# EAGLE design Loader (EAGLE 9.6.0)
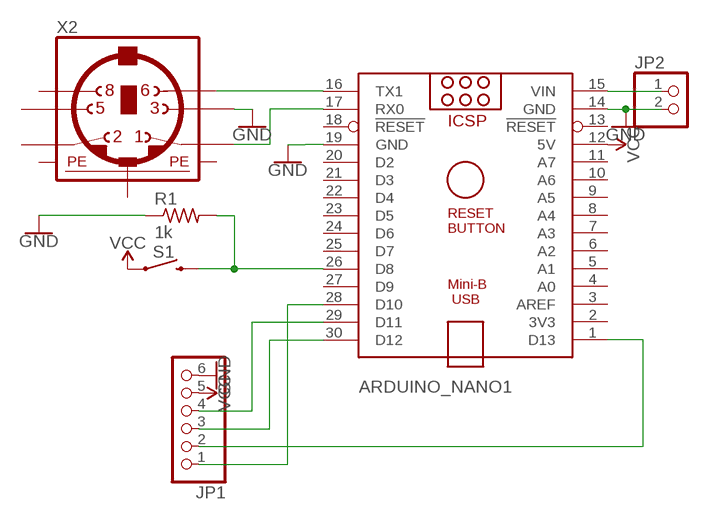
[diagram p0: schematic, sheet 1]

## Parts
ARDUINO_NANO1  ARDUINO_NANO  [ARDUINO_NANO]
JP1  PINHD-1X6  [1X06]
JP2  PINHD-1X2  [1X02]
R1  1k  R-US_0204/7  [0204/7]
S1  MOMENTARY-SWITCH-SPST-PTH-6.0MM  [TACTILE_SWITCH_PTH_6.0MM]
X2  MINI_DIN_6  [M_DIN6]

## Nets
GND: ARDUINO_NANO1.14(GND) ARDUINO_NANO1.19(GND) JP1.6 JP2.2 R1.1 X2.3
N$1: ARDUINO_NANO1.16(TX1) X2.6
N$2: ARDUINO_NANO1.17(RX0) X2.1
N$3: ARDUINO_NANO1.15(VIN) JP2.1
N$5: ARDUINO_NANO1.29(D11) JP1.4
N$6: ARDUINO_NANO1.30(D12) JP1.3
N$7: ARDUINO_NANO1.1(D13) JP1.2
N$8: ARDUINO_NANO1.28(D10) JP1.1
N$9: ARDUINO_NANO1.26(D8) R1.2 S1.3
VCC: ARDUINO_NANO1.12(5V) JP1.5 S1.1
Unconnected: ARDUINO_NANO1.2(3V3) ARDUINO_NANO1.3(AREF) ARDUINO_NANO1.4(A0) ARDUINO_NANO1.5(A1) ARDUINO_NANO1.6(A2) ARDUINO_NANO1.7(A3) ARDUINO_NANO1.8(A4) ARDUINO_NANO1.9(A5) ARDUINO_NANO1.10(A6) ARDUINO_NANO1.11(A7) ARDUINO_NANO1.13(!RESET) ARDUINO_NANO1.18(!RESET) ARDUINO_NANO1.20(D2) ARDUINO_NANO1.21(D3) ARDUINO_NANO1.22(D4) ARDUINO_NANO1.23(D5) ARDUINO_NANO1.24(D6) ARDUINO_NANO1.25(D7) ARDUINO_NANO1.27(D9) X2.2 X2.5 X2.8

## Power pins joined to a net without a drawn wire
PE1: X2.SH1(PE1)
PE2: X2.SH2(PE2)
PE3: X2.SH3(PE3)

## Library data of the parts
ARDUINO_NANO1 = ArduinoNanoV30:ARDUINO_NANO: Arduino Nano V3.0 Overview: The Arduino Nano is a small, complete, and breadboard-friendly board based on the ATmega328 (Arduino Nano 3.x) or ATmega168 (Arduino Nano 2.x). It has more or less the same functionality of the Arduino Duemilanove, but in a different package. It lacks only a DC power jack, and works with a Mini-B USB cable instead of a standard one. The Nano was designed and is being produced by Gravitech. Specifications: Microcontroller Atmel ATmega168 or ATmega328 Operating Voltage (logic level) 5 V Input Voltage (recommended) 7-12 V Input Voltage (limits) 6-20 V Digital I/O Pins 14 (of which 6 provide PWM output) Analog Input Pins 8 DC Current per I/O Pin 40 mA Flash Memory 16 KB (ATmega168) or 32 KB (ATmega328) of which 2 KB used by bootloader SRAM 1 KB (ATmega168) or 2 KB (ATmega328) EEPROM 512 bytes (ATmega168) or 1 KB (ATmega328) Clock Speed 16 MHz Dimensions 0.73" x 1.70" Length 45 mm Width 18 mm Weigth 5 g Power: The Arduino Nano can be powered via the Mini-B USB connection, 6-20V unregulated external power supply (pin 30), or 5V regulated external power supply (pin 27). The power source is automatically selected to the highest voltage source. Memory: The ATmega168 has 16 KB of flash memory for storing code (of which 2 KB is used for the bootloader); the ATmega328 has 32 KB, (also with 2 KB used for the bootloader). The ATmega168 has 1 KB of SRAM and 512 bytes of EEPROM (which can be read and written with the EEPROM library); the ATmega328 has 2 KB of SRAM and 1 KB of EEPROM. Input and Output: Each of the 14 digital pins on the Nano can be used as an input or output, using pinMode(), digitalWrite(), and digitalRead() functions. They operate at 5 volts. Each pin can provide or receive a maximum of 40 mA and has an internal pull-up resistor (disconnected by default) of 20-50 kOhms. In addition, some pins have specialized functions. Visit Arduino - ArduinoBoardNano <https://www.arduino.cc/en/Main/ArduinoBoardNano>
JP1 = adafruit:PINHD-1X6: PIN HEADER
JP2 = pinhead:PINHD-1X2: PIN HEADER
R1 = adafruit:R-US_: RESISTOR, American symbol
S1 = SparkFun-Switches:MOMENTARY-SWITCH-SPST: Momentary Switch (Pushbutton) - SPST Normally-open (NO) SPST momentary switches (buttons, pushbuttons). Variants PTH-12MM - 12mm square, through-hole Momentary Pushbutton Switch - 12mm Square <https://www.sparkfun.com/products/9190> (COM-09190) PTH-6.0MM, PTH-6.0MM-KIT - 6.0mm square, through-hole Mini Pushbutton Switch <https://www.sparkfun.com/products/97> (COM-00097) KIT package intended for soldering kit's - only one side of pads' copper is exposed. PTH-RIGHT-ANGLE-KIT - Right-angle, through-hole Right Angle Tactile Button <https://www.sparkfun.com/products/10791> - Used on SparkFun BigTime Watch Kit <https://www.sparkfun.com/products/11734> SMD-12MM - 12mm square, surface-mount Tactile Button - SMD (12mm) <https://www.sparkfun.com/products/12993> (COM-12993) Used on SparkFun PicoBoard <https://www.sparkfun.com/products/11888> SMD-4.5MM - 4.5mm Square Trackball Switch Used on SparkFun Blackberry Trackballer Breakout <https://www.sparkfun.com/products/13169> SMD-4.6MMX2.8MM - 4.60mm x 2.80mm, surface mount Used on SparkFun SAMD21 Mini Breakout <https://www.sparkfun.com/products/13664> SMD-5.2MM, SMD-5.2-REDUNDANT - 5.2mm square, surface-mount Mini Pushbutton Switch - SMD <https://www.sparkfun.com/products/8720> (COM-08720) Used on Arduino Pro Mini <https://www.sparkfun.com/products/11114> REDUNDANT package connects both switch circuits together SMD-6.0X3.5MM - 6.0 x 3.5mm, surface mount Momentary Reset Switch SMD <https://www.sparkfun.com/products/8229> (COM-08229) SMD-6.2MM-TALL - 6.2mm square, surface mount Tactile Button - SMD (6mm) <https://www.sparkfun.com/products/12992> Used on SparkFun Digital Sandbox <https://www.sparkfun.com/products/12651> SMD-RIGHT-ANGLE - Right-angle, surface mount Used on SparkFun Block for Intel® Edison - Arduino <https://www.sparkfun.com/products/13036>; PROD_ID: SWCH-08441; SF_SKU: COM-00097
X2 = mini_din:MINI_DIN_6

## Board
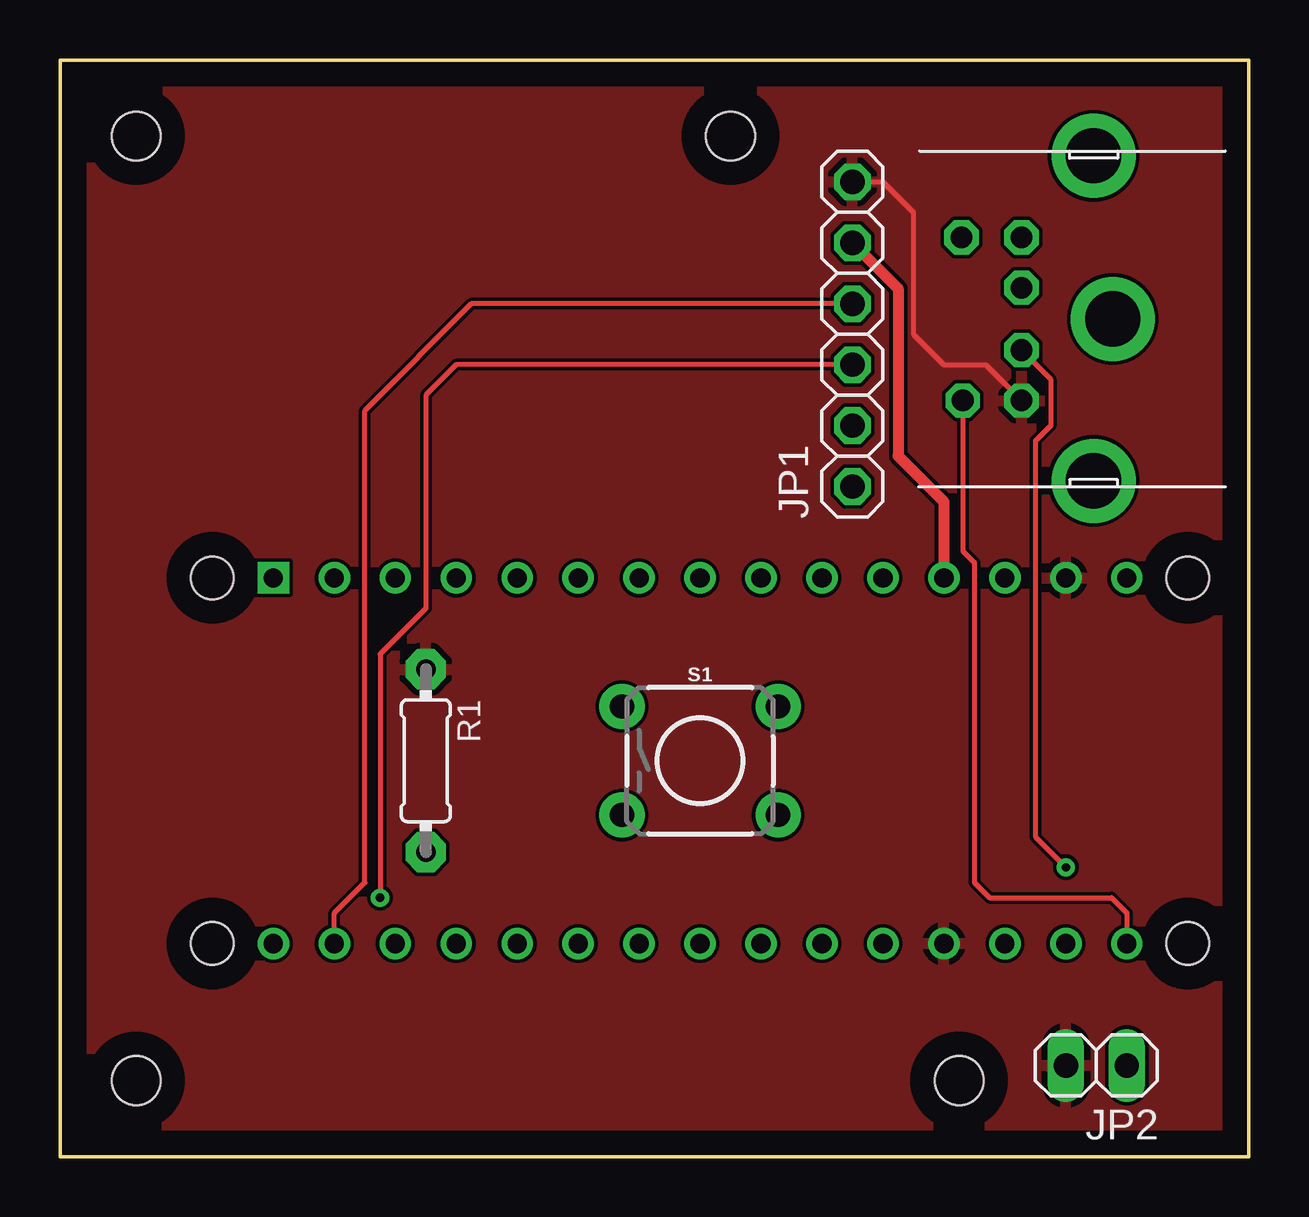
[diagram p1: board, top side]
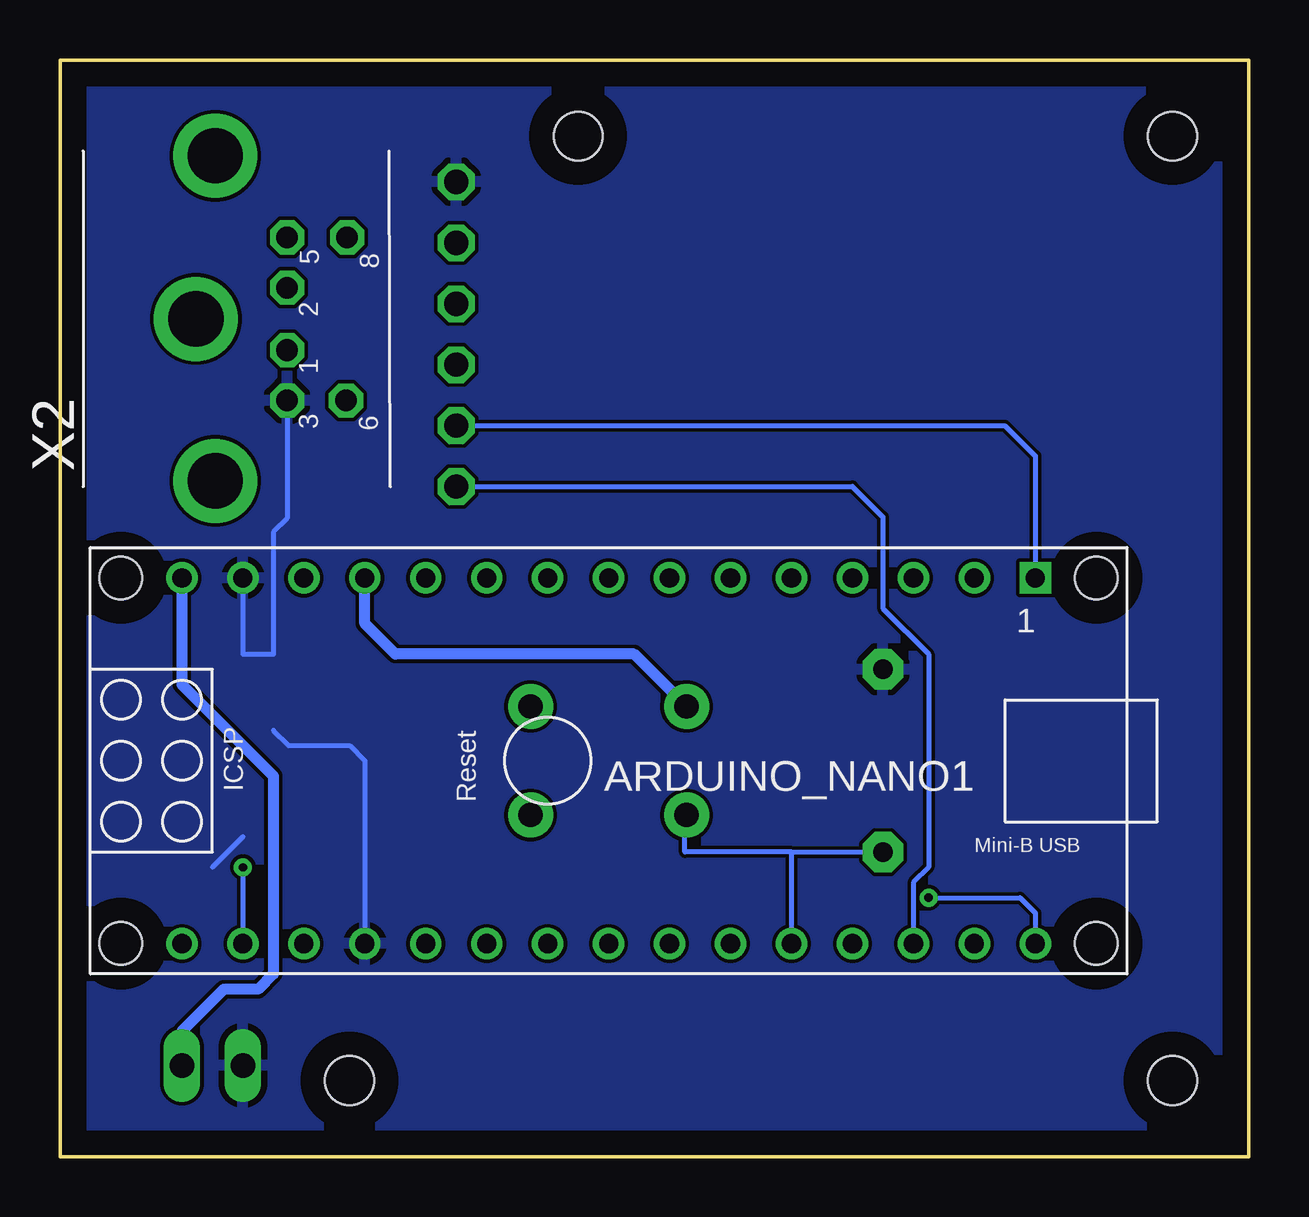
[diagram p2: board, bottom side, seen from below]

Size 49.53 x 45.72 mm. Coordinates in mm from the lower left corner, seen from the top.
Outline: 49.53,0 0,0 0,45.72 49.53,45.72 49.53,0
Copper layers (1*16): Top 0.035mm / dielectric 1.5mm / Bottom 0.035mm
Design rules "default": minimum track width 6mil, minimum drill 0.35mm, track to track 6mil, track to pad 6mil, pad to pad 6mil, via to via 6mil, smd to smd 6mil, copper to edge 40mil, drill to drill 6mil, minimum pad ring 10mil, minimum via ring 8mil, stop-mask expansion 4mil, vias tented up to drill 0mil, thermal gap 10mil
Holes 2.03 mm at 3.18,42.55 3.18,3.17 27.94,42.55 37.46,3.17

### Footprints (pad centres in the part's own frame; a part is rotated, then mirrored left to right if it is on the bottom)
ARDUINO_NANO = drill 0.8 square: 1 -20.32,-7.62 | drill 0.8: 2 -17.78,-7.62; 3 -15.24,-7.62; 4 -12.7,-7.62; 5 -10.16,-7.62; 6 -7.62,-7.62; 7 -5.08,-7.62; 8 -2.54,-7.62; 9 0,-7.62; 10 2.54,-7.62; 11 5.08,-7.62; 12 7.62,-7.62; 13 10.16,-7.62; 14 12.7,-7.62; 15 15.24,-7.62; 16 15.24,7.62; 17 12.7,7.62; 18 10.16,7.62; 19 7.62,7.62; 20 5.08,7.62; 21 2.54,7.62; 22 0,7.62; 23 -2.54,7.62; 24 -5.08,7.62; 25 -7.62,7.62; 26 -10.16,7.62; 27 -12.7,7.62; 28 -15.24,7.62; 29 -17.78,7.62; 30 -20.32,7.62 | hole 1.778: -22.86,-7.62; -22.86,7.62; 17.78,7.62; 17.78,-7.62
1X06 = drill 1.016 octagon: 1 -6.35,0; 2 -3.81,0; 3 -1.27,0; 4 1.27,0; 5 3.81,0; 6 6.35,0
1X02 = drill 1.016 long: 1 -1.27,0; 2 1.27,0
0204/7 = drill 0.813 pad 1.676 octagon: 1 -3.81,0; 2 3.81,0
TACTILE_SWITCH_PTH_6.0MM = drill 1.016 pad 1.88: 1 -3.251,2.261; 2 3.251,2.261; 3 -3.251,-2.261; 4 3.251,-2.261
M_DIN6 = drill 0.9 pad 1.422 octagon: 1 -1.3,-3.75; 2 1.3,-3.75; 3 -3.4,-3.75; 5 3.4,-3.75; 6 -3.4,-6.2; 8 3.4,-6.25 | drill 2.3 pad 3.5: SH1 6.8,-0.75; SH2 0,0.05; SH3 -6.75,-0.75

### Placement (x,y rotation side)
ARDUINO_NANO1  29.21,16.51 180 bottom
JP1  33.02,34.29 90 top
JP2  43.18,3.81 180 top
R1  15.24,16.51 270 top
S1  26.67,16.51 0 top
X2  43.81,34.92 90 bottom

### Tracks (layer width: path | path; a pad name or v marks a point on that pad's centre or on a via)
GND
  Top 0.203: JP1.6 34.29,40.64 35.56,39.37 35.56,34.29 36.83,33.02 38.57,33.02 X2.3
  Bottom 0.203: X2.3 40.06,26.61 40.64,26.04 40.64,20.95 41.91,20.95 ARDUINO_NANO1.14 | 40.64,17.78 40,17.14 37.46,17.14 36.83,16.51 ARDUINO_NANO1.19 | 41.91,13.34 43.18,12.06 | 41.91,4.45 JP2.2
  pour Top: 0,45.72 0,0 49.53,0 49.53,45.72
  pour Bottom: 0,45.72 0,0 49.53,0 49.53,45.72
N$1
  Top 0.203: X2.6 37.61,25.25 38.1,24.77 38.1,11.43 38.73,10.79 43.81,10.79 44.45,10.16 ARDUINO_NANO1.16
N$2  (via drill 0.35)
  Top 0.203: X2.1 41.27,32.41 41.27,30.48 40.64,29.84 40.64,13.34 v41.91,12.06
  Bottom 0.203: v41.91,12.06 ARDUINO_NANO1.17
N$3
  Bottom 0.457: ARDUINO_NANO1.15 44.45,19.68 40.64,15.88 40.64,7.62 41.27,6.99 42.7,6.99 44.45,5.23 JP2.1
N$5
  Top 0.203: JP1.4 17.14,35.56 12.7,31.11 12.7,11.43 11.43,10.16 ARDUINO_NANO1.29
N$6  (via drill 0.35)
  Top 0.203: JP1.3 16.51,33.02 15.24,31.75 15.24,22.86 13.34,20.95 v13.34,10.79
  Bottom 0.203: v13.34,10.79 9.53,10.79 8.89,10.16 ARDUINO_NANO1.30
N$7
  Bottom 0.203: JP1.2 10.16,30.48 8.89,29.21 ARDUINO_NANO1.1
N$8
  Bottom 0.203: JP1.1 16.51,27.94 15.24,26.67 15.24,22.86 13.34,20.95 13.34,12.06 13.97,11.43 ARDUINO_NANO1.28
N$9
  Bottom 0.203: ARDUINO_NANO1.26 19.05,12.7 | 19.05,12.7 R1.2 | S1.3 23.5,14.17 23.5,12.7 19.05,12.7
VCC
  Top 0.457: JP1.5 34.92,36.2 34.92,29.21 36.83,27.3 ARDUINO_NANO1.12
  Bottom 0.457: S1.1 25.6,20.95 35.56,20.95 36.83,22.23 ARDUINO_NANO1.12